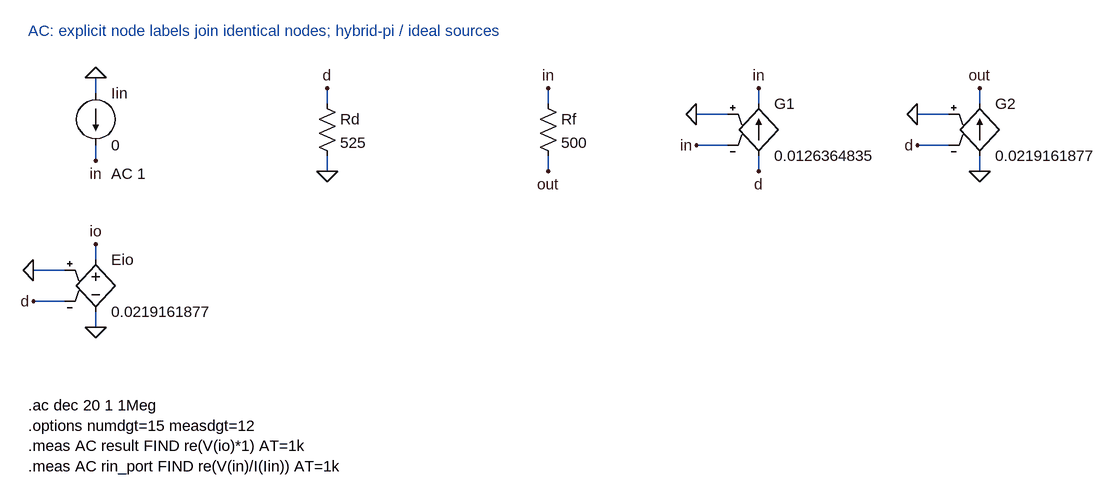
[diagram p0: schematic AC.asc]
AC.asc, the LTspice schematic file:
Version 4
SHEET 1 1800 1500
TEXT 16 -48 Left 2 ;AC: explicit node labels join identical nodes; hybrid-pi / ideal sources
WIRE 120 48 120 24
FLAG 120 24 0
WIRE 120 128 120 152
FLAG 120 152 in
SYMBOL current 120 48 R0
SYMATTR InstName Iin
WINDOW 123 24 124 Left 2
SYMATTR Value 0
SYMATTR Value2 AC 1
WIRE 476 64 476 40
FLAG 476 40 d
WIRE 476 144 476 168
FLAG 476 168 0
SYMBOL res 460 48 R0
SYMATTR InstName Rd
SYMATTR Value 525
WIRE 816 64 816 40
FLAG 816 40 in
WIRE 816 144 816 168
FLAG 816 168 out
SYMBOL res 800 48 R0
SYMATTR InstName Rf
SYMATTR Value 500
WIRE 1140 144 1140 168
FLAG 1140 168 d
WIRE 1140 64 1140 40
FLAG 1140 40 in
WIRE 1092 80 1044 80
FLAG 1044 80 0
WIRE 1092 128 1044 128
FLAG 1044 128 in
SYMBOL g 1140 48 R0
SYMATTR InstName G1
SYMATTR Value 0.0126364835
WIRE 1480 144 1480 168
FLAG 1480 168 0
WIRE 1480 64 1480 40
FLAG 1480 40 out
WIRE 1432 80 1384 80
FLAG 1384 80 0
WIRE 1432 128 1384 128
FLAG 1384 128 d
SYMBOL g 1480 48 R0
SYMATTR InstName G2
SYMATTR Value 0.0219161877
WIRE 120 304 120 280
FLAG 120 280 io
WIRE 120 384 120 408
FLAG 120 408 0
WIRE 72 320 24 320
FLAG 24 320 0
WIRE 72 368 24 368
FLAG 24 368 d
SYMBOL e 120 288 R0
SYMATTR InstName Eio
SYMATTR Value 0.0219161877
TEXT 16 528 Left 2 !.ac dec 20 1 1Meg\n.options numdgt=15 measdgt=12\n.meas AC result FIND re(V(io)*1) AT=1k\n.meas AC rin_port FIND re(V(in)/I(Iin)) AT=1k

The netlist it stands for:
* AC.asc
Iin 0 in 0 AC 1
Rd d 0 525
Rf in out 500
G1 d in 0 in 0.0126364835
G2 0 out 0 d 0.0219161877
Eio io 0 0 d 0.0219161877
* AC: explicit node labels join identical nodes; hybrid-pi / ideal sources
.ac dec 20 1 1Meg
.options numdgt=15 measdgt=12
.meas AC result FIND re(V(io)*1) AT=1k
.meas AC rin_port FIND re(V(in)/I(Iin)) AT=1k
.backanno
.end

* Results of the author's LTspice run, read from the files saved beside the schematic
* From the log:
*   result: re(V(io)*1)=(-0.723881181083dB,180°) at 1000
*   rin_port: re(V(in)/I(Iin))=(16.0251078329dB,0°) at 1000